# Altium project UCLA-DRS4-2.1.PrjPCB (part 7 of 10)

## Sheet 3V_ADC_SUPPLY.SchDoc: My title
size A3; Organization: University of California; Address1: 475 Portola Plaza; Address2: Los Angeles, CA 90095; DocumentNumber: 9; Revision: R01; SheetNumber: 9; SheetTotal: 35
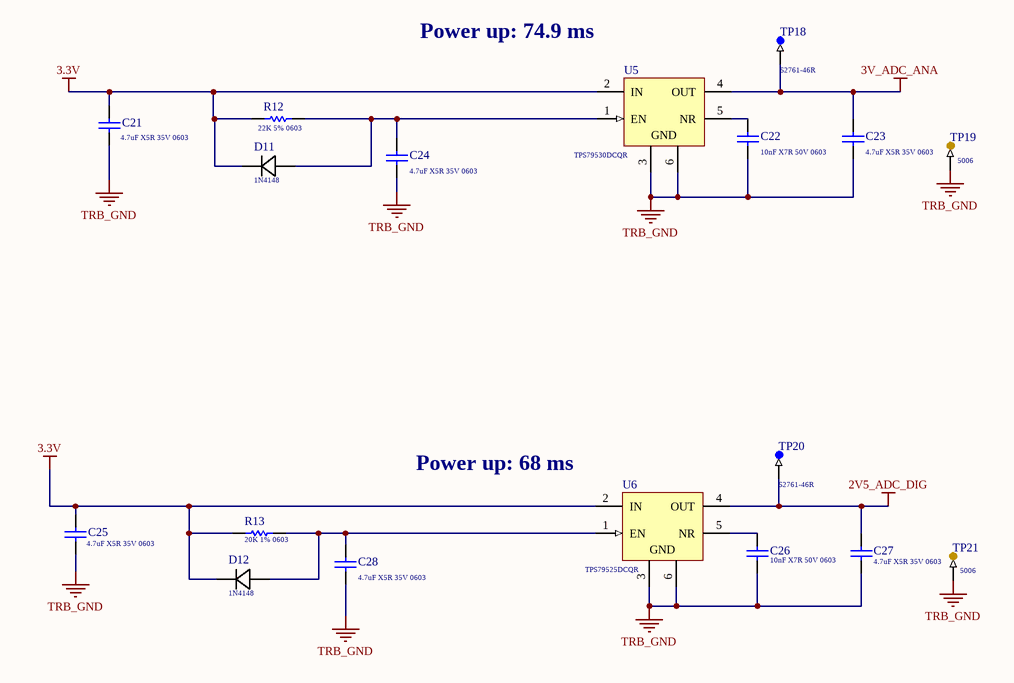
[diagram p18: 3V_ADC_SUPPLY.SchDoc]

### Parts
C21  Capacitance: 4.7uF X5R 35V 0603  [Cap_Murata_ZRB18AR6YA475ME05L_4.7uF]  (hidden comment: Cap_Murata_ZRB18AR6YA475ME05L_4.7uF)
C22  Capacitance: 10nF X7R 50V 0603  [Kemet_C0603_0]  (hidden comment: Cap_Kemet_C0603C103J5RACTU_eec)
C23  Capacitance: 4.7uF X5R 35V 0603  [Cap_Murata_ZRB18AR6YA475ME05L_4.7uF]  (hidden comment: Cap_Murata_ZRB18AR6YA475ME05L_4.7uF)
C24  Capacitance: 4.7uF X5R 35V 0603  [Cap_Murata_ZRB18AR6YA475ME05L_4.7uF]  (hidden comment: Cap_Murata_ZRB18AR6YA475ME05L_4.7uF)
C25  Capacitance: 4.7uF X5R 35V 0603  [Cap_Murata_ZRB18AR6YA475ME05L_4.7uF]  (hidden comment: Cap_Murata_ZRB18AR6YA475ME05L_4.7uF)
C26  Capacitance: 10nF X7R 50V 0603  [Kemet_C0603_0]  (hidden comment: Cap_Kemet_C0603C103J5RACTU_eec)
C27  Capacitance: 4.7uF X5R 35V 0603  [Cap_Murata_ZRB18AR6YA475ME05L_4.7uF]  (hidden comment: Cap_Murata_ZRB18AR6YA475ME05L_4.7uF)
C28  Capacitance: 4.7uF X5R 35V 0603  [Cap_Murata_ZRB18AR6YA475ME05L_4.7uF]  (hidden comment: Cap_Murata_ZRB18AR6YA475ME05L_4.7uF)
D11  Series: 1N4148  [Diode_ON_Semiconductor_1N4148WT_300mA]  (hidden comment: Diode_ON_Semiconductor_1N4148WT_300mA)
D12  Series: 1N4148  [Diode_ON_Semiconductor_1N4148WT_300mA]  (hidden comment: Diode_ON_Semiconductor_1N4148WT_300mA)
R12  22K 5% 0603  [RESC0603(1608)_L]
R13  20K 1% 0603  [RESC0603(1608)_L]
TP18  Series: S2761-46R  [TP_Harwin_S2761_46R]  (hidden comment: TP_Harwin_S2761_46R)
TP19  Series: 5006  [TP_Keystone_Electronics_5006]  (hidden comment: TP_Keystone_Electronics_5006)
TP20  Series: S2761-46R  [TP_Harwin_S2761_46R]  (hidden comment: TP_Harwin_S2761_46R)
TP21  Series: 5006  [TP_Keystone_Electronics_5006]  (hidden comment: TP_Keystone_Electronics_5006)
U5  TPS79530DCQR  [TI-DCQ6_N]
U6  TPS79525DCQR  [DCQ0006A_N]

### Nets
2V5_ADC_DIG: C27.2 TP20.1 U6.4(OUT)
3.3V: C21.2 C25.2 D11.1 D12.1 R12.1 R13.2 U5.2(IN) U6.2(IN)
3V_ADC_ANA: C23.2 TP18.1 U5.4(OUT)
TRB_GND: C21.1 C22.2 C23.1 C24.1 C25.1 C26.2 C27.1 C28.1 TP19.1 TP21.1 U5.3(GND) U5.6(GND) U6.3(GND) U6.6(GND)
NetC22_1: C22.1 U5.5(NR)
NetC24_2: C24.2 D11.2 R12.2 U5.1(EN)
NetC26_1: C26.1 U6.5(NR)
NetC28_2: C28.2 D12.2 R13.1 U6.1(EN)

### Notes on the sheet
- (near U5) Power up: 74.9 ms
- (near U6) Power up: 68 ms
- 475 Portola Plaza
- GAPS TOF
- igarcia91@g.ucla.edu
- Los Angeles, CA
- 310-825-0344
- Size:
- Date:
- Letter
- Revision:
- Time:
- Sheet
- of
- andrew.peck@cern.ch
- spq@ucla.edu
- File:

### Library data of the parts
C21 C23-C25 C27 C28 = Cap_Murata_ZRB18AR6YA475ME05L_4.7uF: CAP CER 4.7uF 35V X5R 0603; Supplier 1: Mouser; Supplier Part Number 1: 81-ZRB18AR6YA475ME5L
C22 C26 = Cap_Kemet_C0603C103J5RACTU_eec: CAP CER 10nF 50V X7R 0603; Manufacturer: Kemet; Mfg Package Ident: C0603; Part Number: C0603C103J5RACTU; helpURL: https://upverter.com/upn/revision/8a8d0c297e33ac74/; ComponentLink2Description: Datasheet; Temperature: -55°C to +125°C; Package: C0603; Supplier 2: Mouser; Price: 0.0184203126773; Supplier 1: Digi-Key; ComponentLink1URL: https://upverter.com/upn/revision/8a8d0c297e33ac74/; Supplier Part Number 2: 80-C0603C103J5R; Supplier Part Number 1: 399-1092-1-ND; Value: 10nF; ComponentLink1Description: Upverter; ComponentLink2URL: https://content.kemet.com/datasheets/KEM_C1002_X7R_SMD.pdf; RoHS: TRUE; Mouser Part Number: 80-C0603C103J5R; Temperature Range High: +125°C; Digikey Description: CAP CER 10000PF 50V X7R 0603; Digikey Part Number: 399-1092-1-ND; Lead Free: yes; Temperature Range Low: -55°C; Voltage: 50V
D11 D12 = Diode_ON_Semiconductor_1N4148WT_300mA: Diodes - General Purpose, Power, Switching SINGLE JUNC. 75V 4.0NS COMP; Supplier 1: Mouser; Supplier Part Number 1: 512-1N4148WT
R12 = CMP-1012-00106-1: 22K 0.1W 5% 0603 (1608 Metric)  SMD; Case-Metric: 1608; Value: 22000.00 Ohm; Case-EIA: 0603; Power: 0.1 W; Tolerance: 5 %; Technology: SMT
R13 = CMP-1012-00655-1: 20K 0.1W 1% 0603 (1608 Metric)  SMD; Case-Metric: 1608; Case-EIA: 0603; Value: 20000.00 Ohm; Technology: SMT; Tolerance: 1 %; Power: 0.1 W
TP18 TP20 = TP_Harwin_S2761_46R: Circuit Board Hardware - PCB SMT Mini Test Terminal, Reel; Supplier 1: Newark; Supplier Part Number 1: 76Y5391
TP19 TP21 = TP_Keystone_Electronics_5006: Circuit Board Hardware - PCB TEST POINT BLK .063; Supplier 1: Mouser; Supplier Part Number 1: 534-5006
U5 = TPS79530DCQR: Single Output High PSRR LDO, 500 mA, Fixed 3 V Output, 2.7 to 5.5 V Input, 6-pin SOT-223 (DCQ), -40 to 125 degC, Green (RoHS & no Sb/Br); Manufacturer: Texas Instruments; Accuracy(%): 2; Iq(Typ)(mA): 0.26; Vin(Min)(V): 2.7; Vout Adj(Min)(V): 3; SubFamily: Single Channel LDO; Vin(Max)(V): 5.5; Rating: Catalog; Iout(Max)(A): 0.5; Vdo(Typ)(mV): 110; Eco-Plan: Green (RoHS & no Sb/Br); PartNumber: TPS79530DCQR; ComponentLink1Description: Manufacturer URL; ComponentLink2Description: Datasheet; DatasheetVersion: SLVS350H; ComponentLink3URL: http://www.ti.com/litv/pdf/mpds098c; Vout Adj(Max)(V): 3; ComponentLink1URL: http://www.ti.com/; Fixed Output Options(V): 3; ComponentLink2URL: http://www.ti.com/general/docs/lit/getliterature.tsp?genericPartNumber=TPS79530&fileType=pdf; ComponentLink3Description: Package Specification; PackageVersion: 4202109/D; Mounting Technology: Surface Mount; PackageReference: DCQ6; PackageDescription: 6-Pin Plastic Small Outline, Body 3.5 x 6.5 mm, Pitch 1.27 mm; Supplier 1: Mouser; Supplier Part Number 1: 595-TPS79530DCQR
U6 = TPS79525DCQR: Single Output High PSRR LDO, 500 mA, Fixed 2.5 V Output, 2.7 to 5.5 V Input, 6-pin SOT-223 (DCQ), -40 to 125 degC, Green (RoHS & no Sb/Br); Manufacturer: Texas Instruments; Accuracy(%): 2; Iq(Typ)(mA): 0.26; Vin(Min)(V): 2.7; Vout Adj(Min)(V): 2.5; SubFamily: Single Channel LDO; Vin(Max)(V): 5.5; Rating: Catalog; Iout(Max)(A): 0.5; Vdo(Typ)(mV): 110; Eco-Plan: Green (RoHS & no Sb/Br); PartNumber: TPS79525DCQR; ComponentLink1Description: Manufacturer URL; ComponentLink2Description: Datasheet; DatasheetVersion: SLVS350H; ComponentLink3URL: http://www.ti.com/litv/pdf/mpds098c; Vout Adj(Max)(V): 2.5; ComponentLink1URL: http://www.ti.com/; Fixed Output Options(V): 2.5; ComponentLink2URL: http://www.ti.com/general/docs/lit/getliterature.tsp?genericPartNumber=TPS79525&fileType=pdf; PackageReference: DCQ0006A; ComponentLink3Description: Package Specification; PackageVersion: 4202109/D; Mounting Technology: Surface Mount; PackageDescription: 6-Pin Plastic Small Outline, Body 3.5 x 6.5 mm, Pitch 1.27 mm; Supplier 1: Mouser; Supplier 2: Digi-Key; Supplier 3: Arrow; Supplier Part Number 3: TPS79525DCQR; Supplier Part Number 2: 296-41778-6-ND; Supplier Part Number 1: 595-TPS79525DCQR

## Sheet MarsCarrier_PWR.SchDoc: My title
size A3; Organization: University of California; Address1: 475 Portola Plaza; Address2: Los Angeles, CA 90095; DocumentNumber: 13; Revision: R01; SheetNumber: 13; SheetTotal: 35
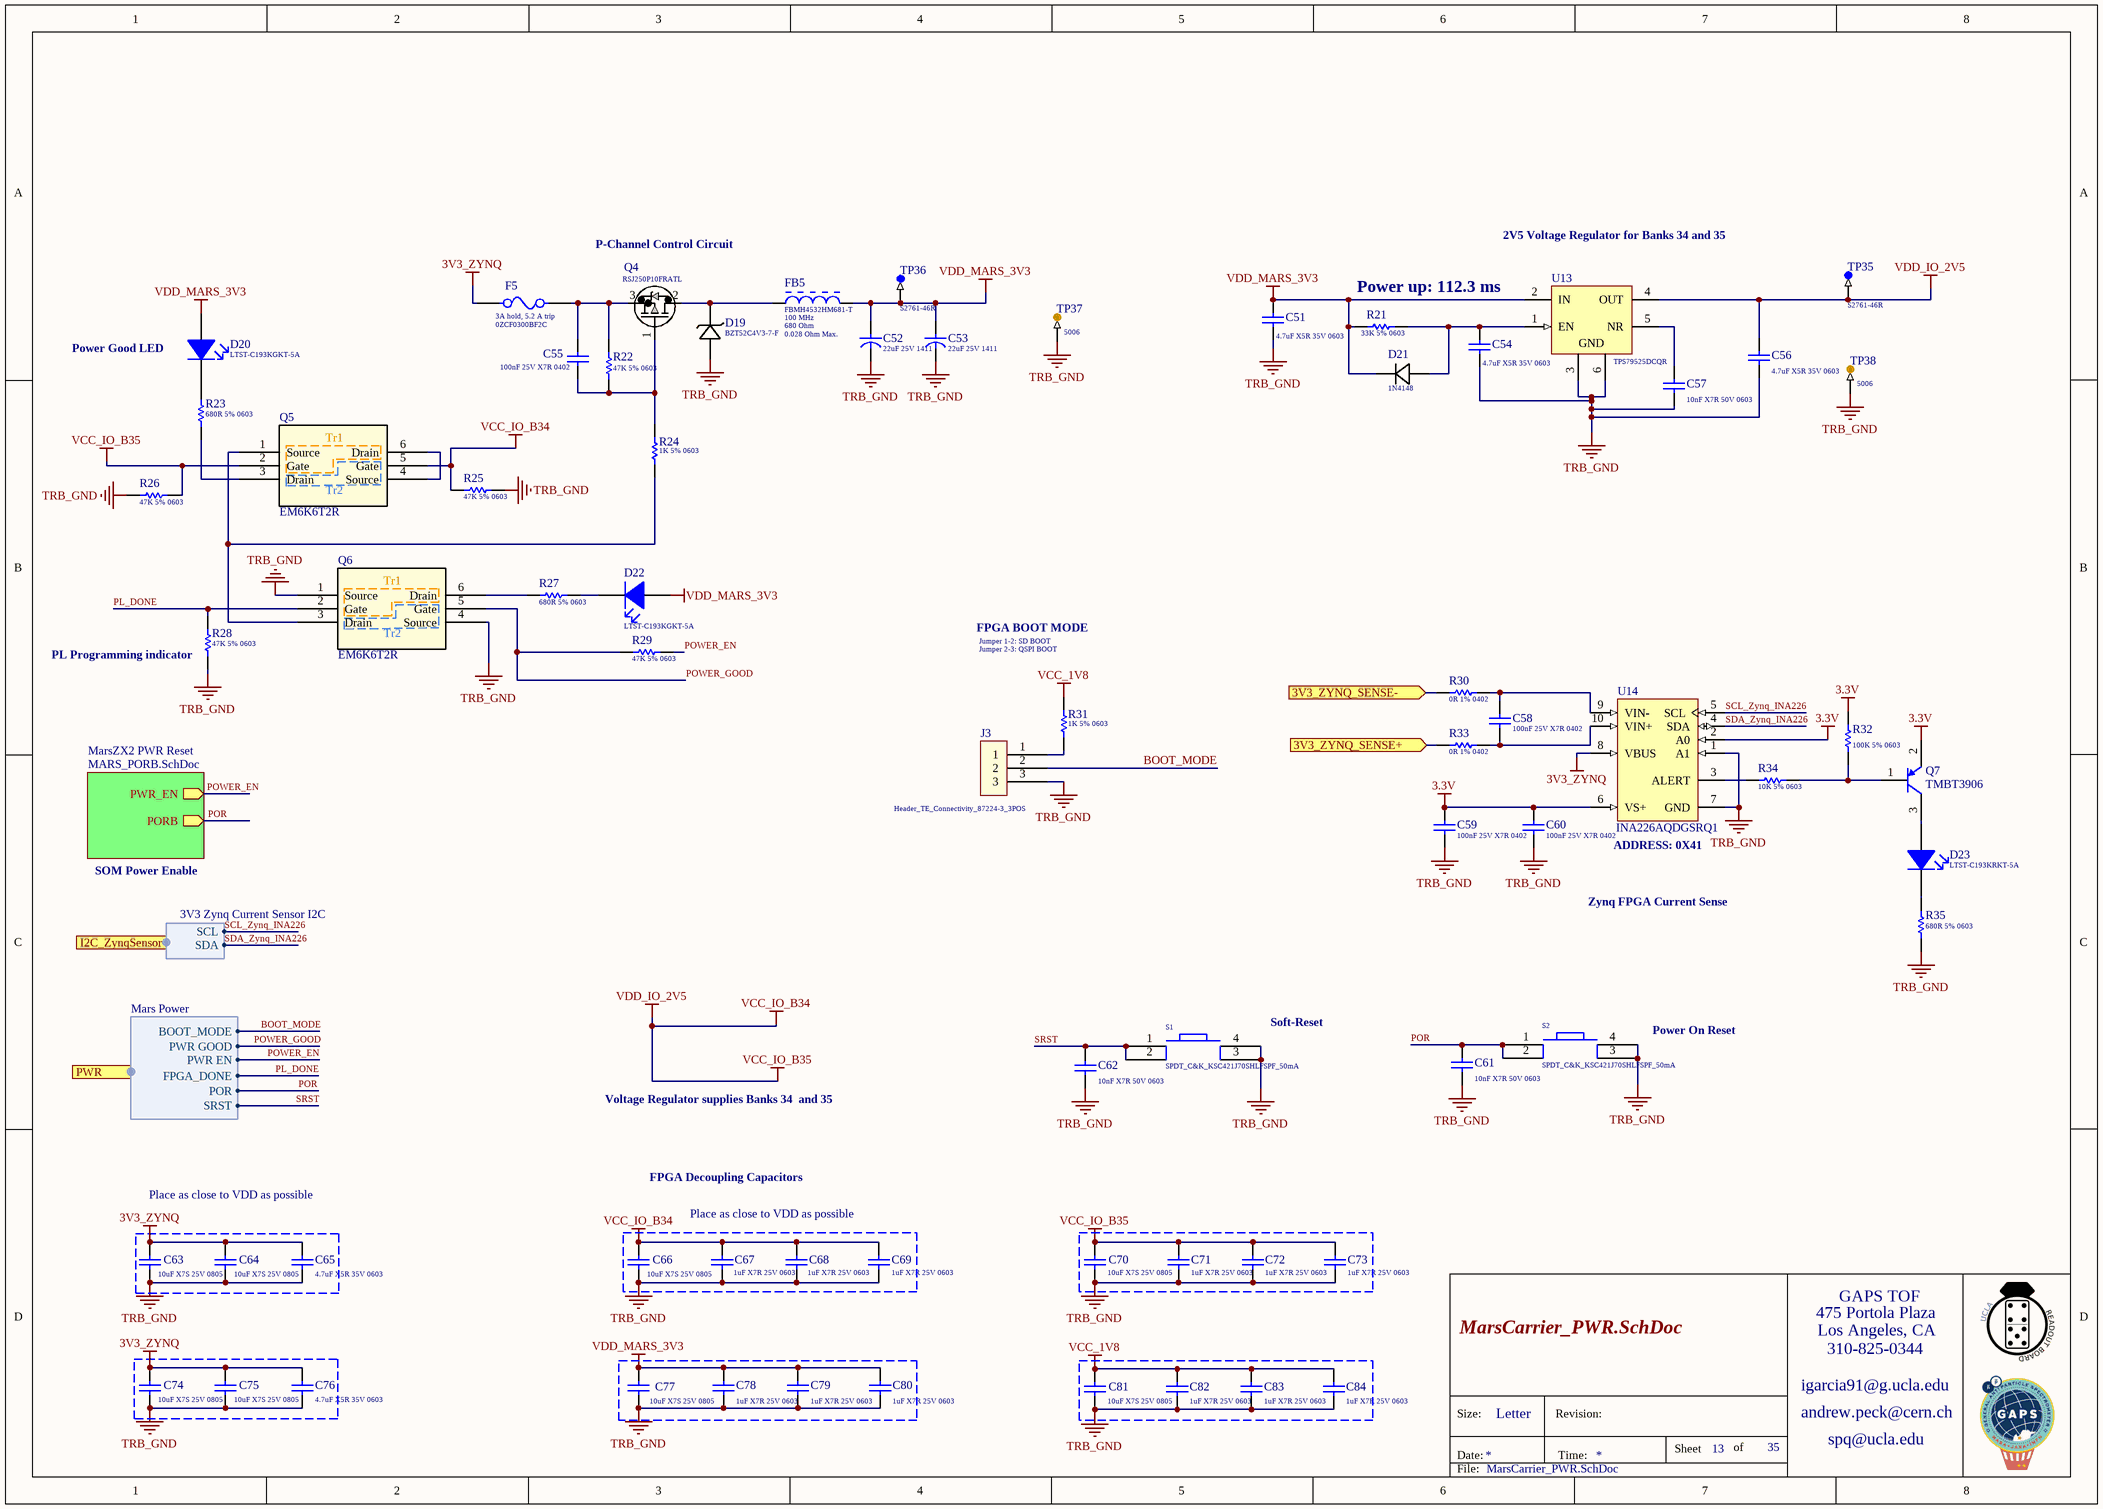
[diagram p19: MarsCarrier_PWR.SchDoc]

### Parts
C51  Capacitance: 4.7uF X5R 35V 0603  [Cap_Murata_ZRB18AR6YA475ME05L_4.7uF]  (hidden comment: Cap_Murata_ZRB18AR6YA475ME05L_4.7uF)
C52  Capacitance: 22uF 25V 1411  [Cap_Kemet_T521B226M025ATE100_22uF]  (hidden comment: Cap_Kemet_T521B226M025ATE100_22uF)
C53  Capacitance: 22uF 25V 1411  [Cap_Kemet_T521B226M025ATE100_22uF]  (hidden comment: Cap_Kemet_T521B226M025ATE100_22uF)
C54  Capacitance: 4.7uF X5R 35V 0603  [Cap_Murata_ZRB18AR6YA475ME05L_4.7uF]  (hidden comment: Cap_Murata_ZRB18AR6YA475ME05L_4.7uF)
C55  Capacitance: 100nF 25V X7R 0402  [Cap_Taiyo_Yuden_TMK105B7104KV-FR_100nF]  (hidden comment: Cap_Taiyo_Yuden_TMK105B7104KV-FR_100nF)
C56  Capacitance: 4.7uF X5R 35V 0603  [Cap_Murata_ZRB18AR6YA475ME05L_4.7uF]  (hidden comment: Cap_Murata_ZRB18AR6YA475ME05L_4.7uF)
C57  Capacitance: 10nF X7R 50V 0603  [Kemet_C0603_0]  (hidden comment: Cap_Kemet_C0603C103J5RACTU_eec)
C58  Capacitance: 100nF 25V X7R 0402  [Cap_Taiyo_Yuden_TMK105B7104KV-FR_100nF]  (hidden comment: Cap_Taiyo_Yuden_TMK105B7104KV-FR_100nF)
C59  Capacitance: 100nF 25V X7R 0402  [Cap_Taiyo_Yuden_TMK105B7104KV-FR_100nF]  (hidden comment: Cap_Taiyo_Yuden_TMK105B7104KV-FR_100nF)
C60  Capacitance: 100nF 25V X7R 0402  [Cap_Taiyo_Yuden_TMK105B7104KV-FR_100nF]  (hidden comment: Cap_Taiyo_Yuden_TMK105B7104KV-FR_100nF)
C61  Capacitance: 10nF X7R 50V 0603  [Kemet_C0603_0]  (hidden comment: Cap_Kemet_C0603C103J5RACTU_eec)
C62  Capacitance: 10nF X7R 50V 0603  [Kemet_C0603_0]  (hidden comment: Cap_Kemet_C0603C103J5RACTU_eec)
C63  Capacitance: 10uF X7S 25V 0805  [Cap_Murata_ GRM21BC71E106ME11L_10uF]  (hidden comment: Cap_Murata_ GRM21BC71E106ME11L_10uF)
C64  Capacitance: 10uF X7S 25V 0805  [Cap_Murata_ GRM21BC71E106ME11L_10uF]  (hidden comment: Cap_Murata_ GRM21BC71E106ME11L_10uF)
C65  Capacitance: 4.7uF X5R 35V 0603  [Cap_Murata_ZRB18AR6YA475ME05L_4.7uF]  (hidden comment: Cap_Murata_ZRB18AR6YA475ME05L_4.7uF)
C66  Capacitance: 10uF X7S 25V 0805  [Cap_Murata_ GRM21BC71E106ME11L_10uF]  (hidden comment: Cap_Murata_ GRM21BC71E106ME11L_10uF)
C67  Capacitance: 1uF X7R 25V 0603  [Cap_Murata_GCJ188R71E105KA01J_1uF]  (hidden comment: Cap_Murata_GCJ188R71E105KA01J_1uF)
C68  Capacitance: 1uF X7R 25V 0603  [Cap_Murata_GCJ188R71E105KA01J_1uF]  (hidden comment: Cap_Murata_GCJ188R71E105KA01J_1uF)
C69  Capacitance: 1uF X7R 25V 0603  [Cap_Murata_GCJ188R71E105KA01J_1uF]  (hidden comment: Cap_Murata_GCJ188R71E105KA01J_1uF)
C70  Capacitance: 10uF X7S 25V 0805  [Cap_Murata_ GRM21BC71E106ME11L_10uF]  (hidden comment: Cap_Murata_ GRM21BC71E106ME11L_10uF)
C71  Capacitance: 1uF X7R 25V 0603  [Cap_Murata_GCJ188R71E105KA01J_1uF]  (hidden comment: Cap_Murata_GCJ188R71E105KA01J_1uF)
C72  Capacitance: 1uF X7R 25V 0603  [Cap_Murata_GCJ188R71E105KA01J_1uF]  (hidden comment: Cap_Murata_GCJ188R71E105KA01J_1uF)
C73  Capacitance: 1uF X7R 25V 0603  [Cap_Murata_GCJ188R71E105KA01J_1uF]  (hidden comment: Cap_Murata_GCJ188R71E105KA01J_1uF)
C74  Capacitance: 10uF X7S 25V 0805  [Cap_Murata_ GRM21BC71E106ME11L_10uF]  (hidden comment: Cap_Murata_ GRM21BC71E106ME11L_10uF)
C75  Capacitance: 10uF X7S 25V 0805  [Cap_Murata_ GRM21BC71E106ME11L_10uF]  (hidden comment: Cap_Murata_ GRM21BC71E106ME11L_10uF)
C76  Capacitance: 4.7uF X5R 35V 0603  [Cap_Murata_ZRB18AR6YA475ME05L_4.7uF]  (hidden comment: Cap_Murata_ZRB18AR6YA475ME05L_4.7uF)
C77  Capacitance: 10uF X7S 25V 0805  [Cap_Murata_ GRM21BC71E106ME11L_10uF]  (hidden comment: Cap_Murata_ GRM21BC71E106ME11L_10uF)
C78  Capacitance: 1uF X7R 25V 0603  [Cap_Murata_GCJ188R71E105KA01J_1uF]  (hidden comment: Cap_Murata_GCJ188R71E105KA01J_1uF)
C79  Capacitance: 1uF X7R 25V 0603  [Cap_Murata_GCJ188R71E105KA01J_1uF]  (hidden comment: Cap_Murata_GCJ188R71E105KA01J_1uF)
C80  Capacitance: 1uF X7R 25V 0603  [Cap_Murata_GCJ188R71E105KA01J_1uF]  (hidden comment: Cap_Murata_GCJ188R71E105KA01J_1uF)
C81  Capacitance: 10uF X7S 25V 0805  [Cap_Murata_ GRM21BC71E106ME11L_10uF]  (hidden comment: Cap_Murata_ GRM21BC71E106ME11L_10uF)
C82  Capacitance: 1uF X7R 25V 0603  [Cap_Murata_GCJ188R71E105KA01J_1uF]  (hidden comment: Cap_Murata_GCJ188R71E105KA01J_1uF)
C83  Capacitance: 1uF X7R 25V 0603  [Cap_Murata_GCJ188R71E105KA01J_1uF]  (hidden comment: Cap_Murata_GCJ188R71E105KA01J_1uF)
C84  Capacitance: 1uF X7R 25V 0603  [Cap_Murata_GCJ188R71E105KA01J_1uF]  (hidden comment: Cap_Murata_GCJ188R71E105KA01J_1uF)
D19  BZT52C4V3-7-F  [SOD123]
D20  Series: LTST-C193KGKT-5A  [Led_Lite-On_LTST-C193KGKT-5A_Green]  (hidden comment: Led_Lite-On_LTST-C193KGKT-5A_Green)
D21  Series: 1N4148  [Diode_ON_Semiconductor_1N4148WT_300mA]  (hidden comment: Diode_ON_Semiconductor_1N4148WT_300mA)
D22  Series: LTST-C193KGKT-5A  [Led_Lite-On_LTST-C193KGKT-5A_Green]  (hidden comment: Led_Lite-On_LTST-C193KGKT-5A_Green)
D23  LTST-C193KRKT-5A  [Led_Lite-On_LTST-C193KGKT-5A_Red]
F5  3A hold, 5.2 A trip  [Bel_0ZCF_MFG]
FB5  Measuring Frequency: 100 MHz  Nominal Impedance: 680 Ohm  DC Resistance: 0.028 Ohm Max.  [TAYO-FBMH4532-2_V]  (hidden comment: FBMH4532HM681-T)
J3  Header_TE_Connectivity_87224-3_3POS  [Header_TE_Connectivity_87224-3_3POS]
Q4  Series: RSJ250P10FRATL  [Mos_ROHM_RSJ250P10FRATL_25A]  (hidden comment: Mos_ROHM_RSJ250P10FRATL_25A)
Q5  EM6K6T2R  [TRANS_EM6_ROM]
Q6  EM6K6T2R  [TRANS_EM6_ROM]
Q7  Series: TMBT3906  [BJT_PNP_Toshiba_TMBT3906]  (hidden comment: BJT_PNP_Toshiba_TMBT3906)
R21  33K 5% 0603  [RESC0603(1608)_L]
R22  47K 5% 0603  [RESC0603(1608)_L]
R23  680R 5% 0603  [RESC0603(1608)_L]
R24  1K 5% 0603  [RESC0603(1608)_L]
R25  47K 5% 0603  [RESC0603(1608)_L]
R26  47K 5% 0603  [RESC0603(1608)_L]
R27  680R 5% 0603  [RESC0603(1608)_L]
R28  47K 5% 0603  [RESC0603(1608)_L]
R29  47K 5% 0603  [RESC0603(1608)_L]
R30  Resistance: 0R 1% 0402  [Res_Vishay_CRCW04020000Z0EDC_0_Ohm]  (hidden comment: Res_Vishay_CRCW04020000Z0EDC_0_Ohm)
R31  1K 5% 0603  [RESC0603(1608)_L]
R32  100K 5% 0603  [RESC0603(1608)_N]
R33  Resistance: 0R 1% 0402  [Res_Vishay_CRCW04020000Z0EDC_0_Ohm]  (hidden comment: Res_Vishay_CRCW04020000Z0EDC_0_Ohm)
R34  10K 5% 0603  [RESC0603(1608)_L]
R35  680R 5% 0603  [RESC0603(1608)_L]
S1  SPDT_C&K_KSC421J70SHLFSPF_50mA  [SPDT_C&K_KSC421J70SHLFSPF_50mA]
S2  SPDT_C&K_KSC421J70SHLFSPF_50mA  [SPDT_C&K_KSC421J70SHLFSPF_50mA]
TP35  Series: S2761-46R  [TP_Harwin_S2761_46R]  (hidden comment: TP_Harwin_S2761_46R)
TP36  Series: S2761-46R  [TP_Harwin_S2761_46R]  (hidden comment: TP_Harwin_S2761_46R)
TP37  Series: 5006  [TP_Keystone_Electronics_5006]  (hidden comment: TP_Keystone_Electronics_5006)
TP38  Series: 5006  [TP_Keystone_Electronics_5006]  (hidden comment: TP_Keystone_Electronics_5006)
U13  TPS79525DCQR  [DCQ0006A_L]
U14  INA226AQDGSRQ1  [INA226AQDGSRQ1]

### Blocks framed on the sheet
Place as close to VDD as possible: C66-C69

### Sub-sheets
MarsZX2 PWR Reset = MARS_PORB.SchDoc: PWR_EN (out), PORB (out)

### Ports
3V3_ZYNQ_SENSE+ (in), 3V3_ZYNQ_SENSE- (in), I2C_ZynqSensor (harness 3V3 Zynq Current Sensor I2C), PWR (harness Mars Power)

### Harnesses
Mars Power: PWR GOOD, PWR EN, FPGA_DONE, SRST, POR, BOOT_MODE
3V3 Zynq Current Sensor I2C: SCL, SDA

### Nets
3.3V: C59.2 C60.2 Q7.2(E) R32.2 U14.2(A0) U14.6(VS+)
3V3_ZYNQ: C63.1 C64.1 C65.1 C74.1 C75.1 C76.1 F5.1 U14.8(VBUS)  [project net VCC_3V3]
TRB_GND: C51.1 C52.2 C53.2 C54.1 C56.1 C57.2 C59.1 C60.1 C61.2 C62.2 C63.2 C64.2 C65.2 C66.2 C67.1 C68.1 C69.1 C70.2 C71.1 C72.1 C73.1 C74.2 C75.2 C76.2 C77.2 C78.1 C79.1 C80.1 C81.2 C82.1 C83.1 C84.1 D19.2 J3.3 Q6.1(Source) Q6.4(Source) R25.2 R26.2 R28.1 R35.1 S1.3 S1.4 S2.3 S2.4 TP37.1 TP38.1 U13.3(GND) U13.6(GND) U14.1(A1) U14.7(GND)
VCC_1V8: C81.1 C82.2 C83.2 C84.2 R31.2  [project net VCC_1V8_PS]
VCC_IO_B34: C56.2 C66.1 C67.2 C68.2 C69.2 C70.1 C71.2 C72.2 C73.2 Q5.2(Gate) Q5.5(Gate) R25.1 R26.1 TP35.1 U13.4(OUT)  [also labelled VCC_IO_B35, VDD_IO_2V5]
VDD_MARS_3V3: C51.2 C52.1 C53.1 C77.1 C78.2 C79.2 C80.2 D20.2(A) D21.1 D22.2(A) FB5.2 R21.1 TP36.1 U13.2(IN)
3V3_ZYNQ_SENSE_N: R30.1 ; port 3V3_ZYNQ_SENSE-
3V3_ZYNQ_SENSE_P: R33.1 ; port 3V3_ZYNQ_SENSE+
BOOT_MODE: J3.2 ; port PWR.BOOT_MODE
PL_DONE: Q6.2(Gate) R28.2 ; port PWR.FPGA_DONE  [project net FPGA_DONE]
POR: C61.1 S2.1 S2.2 ; sheet MarsZX2 PWR Reset/PORB, port PWR.POR
POWER_EN: R29.1 ; sheet MarsZX2 PWR Reset/PWR_EN, port PWR.PWR EN
POWER_GOOD: Q6.5(Gate) R29.2 ; port PWR.PWR GOOD
SCL_Zynq_INA226: U14.5(SCL) ; port I2C_ZynqSensor.SCL
SDA_Zynq_INA226: U14.4(SDA) ; port I2C_ZynqSensor.SDA
SRST: C62.1 S1.1 S1.2 ; port PWR.SRST  [project net PS_SRST#]
NetC54_2: C54.2 D21.2 R21.2 U13.1(EN)
NetC55_1: C55.1 Q4.1(G) R22.1 R24.2
NetC55_2: C55.2 F5.2 Q4.3(S) R22.2
NetC57_1: C57.1 U13.5(NR)
NetC58_1: C58.1 R33.2 U14.10(VIN+)
NetC58_2: C58.2 R30.2 U14.9(VIN-)
NetD19_1: D19.1 FB5.1 Q4.2(D)
NetD20_1: D20.1(K) R23.2
NetD22_1: D22.1(K) R27.1
NetD23_1: D23.1(K) R35.2
NetD23_2: D23.2(A) Q7.3(C)
NetJ3_1: J3.1 R31.1
NetQ5_1: Q5.1(Source) Q6.3(Drain) R24.1
NetQ5_3: Q5.3(Drain) R23.1
NetQ5_4: Q5.4(Source) Q5.6(Drain)
NetQ6_6: Q6.6(Drain) R27.2
NetQ7_1: Q7.1(B) R32.1 R34.1
NetR34_2: R34.2 U14.3(ALERT)

### Notes on the sheet
- P-Channel Control Circuit
- 2V5 Voltage Regulator for Banks 34 and 35
- Power up: 112.3 ms
- Power Good LED
- FPGA BOOT MODE
- Jumper 1-2: SD BOOT
- Jumper 2-3: QSPI BOOT
- (near R28) PL Programming indicator
- (near U14) ADDRESS: 0X41
- SOM Power Enable
- Zynq FPGA Current Sense
- (near S1) Soft-Reset
- Power On Reset
- Voltage Regulator supplies Banks 34  and 35
- FPGA Decoupling Capacitors
- Place as close to VDD as possible
- 475 Portola Plaza
- GAPS TOF
- igarcia91@g.ucla.edu
- Los Angeles, CA
- 310-825-0344
- Size:
- Date:
- Letter
- Revision:
- Time:
- Sheet
- of
- andrew.peck@cern.ch
- spq@ucla.edu
- File:
- (in symbol EM6K6T2R) Tr1; Tr2

### Library data of the parts
C51 C54 C56 C65 C76 = Cap_Murata_ZRB18AR6YA475ME05L_4.7uF: CAP CER 4.7uF 35V X5R 0603; Supplier 1: Mouser; Supplier Part Number 1: 81-ZRB18AR6YA475ME5L
C52 C53 = Cap_Kemet_T521B226M025ATE100_22uF: Tantalum Capacitors - Polymer SMD 25V 22uF 1311 20% ESR=100mOhms; Supplier 1: Mouser; Supplier Part Number 1: 80-T521B226M25ATE100
C55 C58-C60 = Cap_Taiyo_Yuden_TMK105B7104KV-FR_100nF: CAP CER 100nF 25V X7R 0402; Supplier 1: Mouser; Supplier Part Number 1: 963-TMK105B7104KV-FR
C57 C61 C62 = Cap_Kemet_C0603C103J5RACTU_eec: as C22 on sheet 3V_ADC_SUPPLY; Part Number: C0603C103J5RACTU; helpURL: https://upverter.com/upn/revision/8a8d0c297e33ac74/; ComponentLink2Description: Datasheet; Temperature: -55°C to +125°C; Package: C0603; Supplier 2: Mouser; Price: 0.0184203126773; Supplier 1: Digi-Key; ComponentLink1URL: https://upverter.com/upn/revision/8a8d0c297e33ac74/; Supplier Part Number 2: 80-C0603C103J5R; Supplier Part Number 1: 399-1092-1-ND; Value: 10nF; ComponentLink1Description: Upverter; ComponentLink2URL: https://content.kemet.com/datasheets/KEM_C1002_X7R_SMD.pdf; RoHS: TRUE; Mouser Part Number: 80-C0603C103J5R; Temperature Range High: +125°C; Digikey Description: CAP CER 10000PF 50V X7R 0603; Digikey Part Number: 399-1092-1-ND; Lead Free: yes; Temperature Range Low: -55°C; Voltage: 50V
C63 C64 C66 C70 C74 C75 C77 C81 = Cap_Murata_ GRM21BC71E106ME11L_10uF: CAP CER 10uF 25V X7R 0805; Supplier 1: Mouser; Supplier Part Number 1: 81-GRM21BC71E106ME1L
C67-C69 C71-C73 C78-C80 C82-C84 = Cap_Murata_GCJ188R71E105KA01J_1uF: CAP CER 1uF 25V X7R 0603; Supplier 1: Mouser; Supplier Part Number 1: 81-GCJ188R71E105KA1J
D19 = BZT52C4V3-7-F: Zener Diodes 500mW 4.3V Zener AEC-Q101 Qualified; Vendor: Diodes Inc; Built_By: EMA_UL_Team; Type: DEV; C: Copyright (C) 2015 Accelerated Designs. All rights reserved; Manufacturer_Part_Number: BZT52C4V3-7-F; RefDes: RefDes; Supplier 1: Mouser; Supplier Part Number 1: 621-BZT52C4V3-F; Series: BZT52C4V3-7-F
D20 D22 = Led_Lite-On_LTST-C193KGKT-5A_Green: Standard LEDs - SMD Green 470nm 28mcd 20mA; Supplier 1: Mouser; Supplier Part Number 1: 859-LTSTC193KGKT5A
D21 = Diode_ON_Semiconductor_1N4148WT_300mA: as D11 on sheet 3V_ADC_SUPPLY; Supplier 1: Mouser; Supplier Part Number 1: 512-1N4148WT
D23 = Led_Lite-On_LTST-C193KGKT-5A_Red: Standard LEDs - SMD Red 470nm 28mcd 20mA; Supplier 1: Mouser; Supplier Part Number 1: 859-LTSTC193KRKT5A; Series: LTST-C193KRKT-5A
F5 = 0ZCF0300BF2C: Resettable Fuses - PPTC 3A 24V PPTC 2920 SMD; Supplier 1: Mouser; Supplier 2: Digi-Key; Supplier Part Number 1: 530-0ZCF0300BF2C; Supplier Part Number 2: 507-2072-6-ND; Series: 0ZCF0300BF2C
FB5 = FBMH4532HM681-T: Chip Bead Inductor for Power Lines, 680 Ohm, 4 A, -40 to 125 degC, 2-Pin 4.5 x 3.2 x 3.5 mm SMD, RoHS, Taping; Manufacturer: Taiyo Yuden; Rated Current: 4 A Max.; Impedance Tolerance: +/- 25%; ComponentLink1Description: Manufacturer URL; ComponentLink2Description: Datasheet; DatasheetVersion: 09/2014; ComponentLink3URL: http://www.yuden.co.jp/productdata/catalog/en/chipbeads01_e.pdf; ComponentLink3Description: Package Specification; ComponentLink1URL: http://www.t-yuden.com/; Mounting Technology: Surface Mount; Packing: Taping; Temperature Range: -40 to 125 degC; PartNumber: FBMH4532HM681-T; PackageDescription: 2-Pin Surface Mount Device, Body 4.5 x 3.2 mm, Height 3.5 mm; ComponentLink2URL: http://www.yuden.co.jp/productdata/catalog/en/chipbeads01_e.pdf; RoHS: TRUE; Supplier 1: Digi-Key; Supplier Part Number 1: 587-1761-6-ND
J3 = Header_TE_Connectivity_87224-3_3POS: Headers & Wire Housings UNSHRD VERT SNGL 3; Supplier 1: Mouser; Supplier Part Number 1: 571-872243
Q4 = Mos_ROHM_RSJ250P10FRATL_25A: MOSFET Pch -100V Vds -25A 0.05Rds(on) 60Qg; Supplier Part Number 1: 755-RSJ250P10FRATL; Supplier 1: Mouser
Q5 Q6 = EM6K6T2R: MOSFET Small Signal Dual N-CH 20V .3A .15W; Vendor: ROHM Semiconductor; Manufacturer_Part_Number: EM6K6T2R
Q7 = BJT_PNP_Toshiba_TMBT3906: Bipolar Transistors - BJT Transistor for Low Freq. Amplification; Manufacturer Part Number 1: TMBT3906,LM; Supplier 1: Mouser; Supplier Part Number 1: 757-TMBT3906LM; Manufacturer: Toshiba
R21 = CMP-1012-00110-1: 33K 0.1W 5% 0603 (1608 Metric)  SMD; Value: 33000.00 Ohm; Case-EIA: 0603; Case-Metric: 1608; Tolerance: 5 %; Power: 0.1 W; Technology: SMT
R22 R25 R26 R28 R29 = CMP-1012-00114-1: 47K 0.1W 5% 0603 (1608 Metric)  SMD; Case-EIA: 0603; Value: 47000.00 Ohm; Case-Metric: 1608; Tolerance: 5 %; Power: 0.1 W; Technology: SMT
R23 R27 R35 = CMP-1012-00070-1: 680R 0.1W 5% 0603 (1608 Metric)  SMD; Case-EIA: 0603; Value: 680.00 Ohm; Case-Metric: 1608; Tolerance: 5 %; Technology: SMT; Power: 0.1 W
R24 R31 = CMP-1012-00074-1: 1K 0.1W 5% 0603 (1608 Metric)  SMD; Case-EIA: 0603; Case-Metric: 1608; Value: 1000.00 Ohm; Technology: SMT; Tolerance: 5 %; Power: 0.1 W
R30 R33 = Res_Vishay_CRCW04020000Z0EDC_0_Ohm: 0R 0.062W 1% 0402 (1005 Metric)  SMD; Supplier 1: Mouser; Supplier Part Number 1: 71-CRCW04020000Z0EDC
R32 = CMP-1012-00122-1: 100K 0.1W 5% 0603 (1608 Metric)  SMD; Case-EIA: 0603; Value: 100000.00 Ohm; Case-Metric: 1608; Tolerance: 5 %; Power: 0.1 W; Technology: SMT
R34 = CMP-1012-00098-1: 10K 0.1W 5% 0603 (1608 Metric)  SMD; Case-EIA: 0603; Value: 10000.00 Ohm; Case-Metric: 1608; Technology: SMT; Tolerance: 5 %; Power: 0.1 W
S1 S2 = SPDT_C&K_KSC421J70SHLFSPF_50mA: Tactile Switches Tact 6.2 x 6.2, 5.1 mm H, 1.7N, J leads, Potting Friendly, IP67; Supplier 1: Mouser; Supplier Part Number 1: 611-KSC421J70SHLFSPF
TP35 TP36 = TP_Harwin_S2761_46R: as TP18 on sheet 3V_ADC_SUPPLY; Supplier 1: Newark; Supplier Part Number 1: 76Y5391
TP37 TP38 = TP_Keystone_Electronics_5006: as TP19 on sheet 3V_ADC_SUPPLY; Supplier 1: Mouser; Supplier Part Number 1: 534-5006
U13 = CMP-0395-00444-2: Single Output High PSRR LDO, 500 mA, Fixed 2.5 V Output, 2.7 to 5.5 V Input, 6-pin SOT-223 (DCQ), -40 to 125 degC, Green (RoHS & no Sb/Br); Manufacturer: Texas Instruments; Iout(Max)(A): 0.5; Vout Adj(Min)(V): 2.5; Vin(Max)(V): 5.5; SubFamily: Single Channel LDO; Vdo(Typ)(mV): 110; Rating: Catalog; Accuracy(%): 2; Iq(Typ)(mA): 0.26; Vin(Min)(V): 2.7; ComponentLink3URL: http://www.ti.com/litv/pdf/mpds098c; ComponentLink1URL: http://www.ti.com/; Eco-Plan: Green (RoHS & no Sb/Br); PackageDescription: 6-Pin Plastic Small Outline, Body 3.5 x 6.5 mm, Pitch 1.27 mm; PartNumber: TPS79525DCQR; Fixed Output Options(V): 2.5; ComponentLink1Description: Manufacturer URL; PackageReference: DCQ0006A; ComponentLink2Description: Datasheet; Vout Adj(Max)(V): 2.5; ComponentLink3Description: Package Specification; ComponentLink2URL: http://www.ti.com/general/docs/lit/getliterature.tsp?genericPartNumber=TPS79525&fileType=pdf; Mounting Technology: Surface Mount; DatasheetVersion: SLVS350H; PackageVersion: 4202109/D; Supplier 1: Mouser; Supplier Part Number 1: 595-TPS79525DCQR
U14 = INA226AQDGSRQ1: Current & Power Monitors & Regulators Automotive, 36-V, Ultra-High Accuracy, Low-/High-Side, I2C Out Current/Power Monitor w/ Alert 10-VSSOP -40 to 125; Supplier 1: Mouser; Supplier Part Number 1: 595-INA226AQDGSRQ1

## Sheet MARS_PORB.SchDoc: My title
size A3; Organization: University of California; Address1: 475 Portola Plaza; Address2: Los Angeles, CA 90095; DocumentNumber: 35; Revision: R01; SheetNumber: 35; SheetTotal: 35
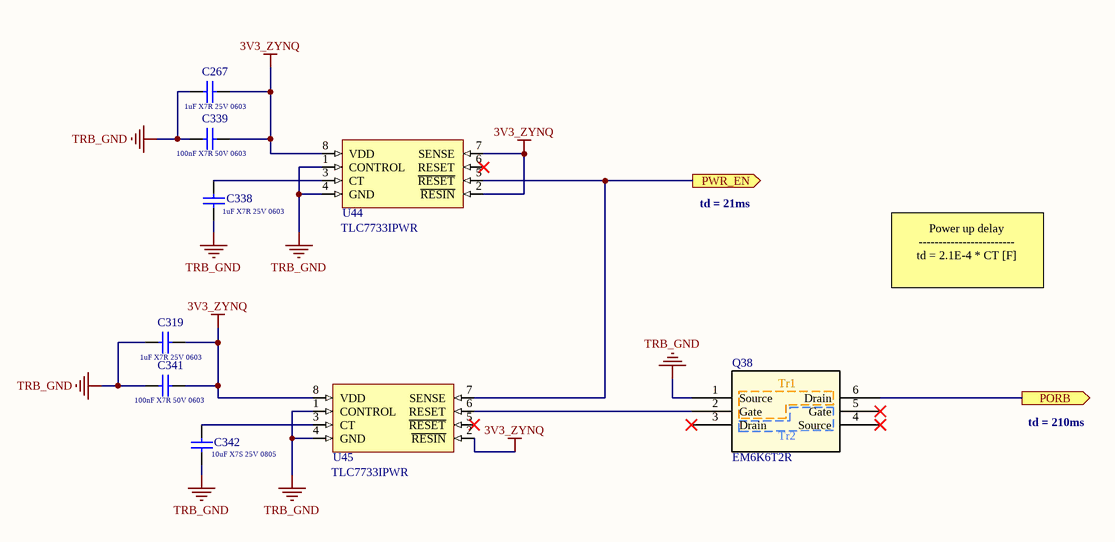
[diagram p20: MARS_PORB.SchDoc]

### Parts
C267  Capacitance: 1uF X7R 25V 0603  [Cap_Murata_GCJ188R71E105KA01J_1uF]  (hidden comment: Cap_Murata_GCJ188R71E105KA01J_1uF)
C319  Capacitance: 1uF X7R 25V 0603  [Cap_Murata_GCJ188R71E105KA01J_1uF]  (hidden comment: Cap_Murata_GCJ188R71E105KA01J_1uF)
C338  Capacitance: 1uF X7R 25V 0603  [Cap_Murata_GCJ188R71E105KA01J_1uF]  (hidden comment: Cap_Murata_GCJ188R71E105KA01J_1uF)
C339  Capacitance: 100nF X7R 50V 0603  [Cap_Kemet_C0603C104M5RACAUTO_100nF]  (hidden comment: Cap_Kemet_C0603C104M5RACAUTO_100nF)
C341  Capacitance: 100nF X7R 50V 0603  [Cap_Kemet_C0603C104M5RACAUTO_100nF]  (hidden comment: Cap_Kemet_C0603C104M5RACAUTO_100nF)
C342  Capacitance: 10uF X7S 25V 0805  [Cap_Murata_ GRM21BC71E106ME11L_10uF]  (hidden comment: Cap_Murata_ GRM21BC71E106ME11L_10uF)
Q38  EM6K6T2R  [TRANS_EM6_ROM]
U44  TLC7733IPWR  [PMU_Texas_Instruments_TLC7733IPWR_2.93]
U45  TLC7733IPWR  [PMU_Texas_Instruments_TLC7733IPWR_2.93]

### Ports
PORB (out), PWR_EN (out)

### Nets
3V3_ZYNQ: C267.1 C319.1 C339.1 C341.1 U44.2(~{RESIN}) U44.7(SENSE) U44.8(VDD) U45.2(~{RESIN}) U45.8(VDD)  [project net VCC_3V3]
TRB_GND: C267.2 C319.2 C338.1 C339.2 C341.2 C342.2 Q38.1(Source) U44.1(CONTROL) U44.4(GND) U45.1(CONTROL) U45.4(GND)
POR: Q38.6(Drain) ; port PORB
POWER_EN: U44.5(~{RESET}) U45.7(SENSE) ; port PWR_EN
NetC338_2: C338.2 U44.3(CT)
NetC342_1: C342.1 U45.3(CT)
NetQ38_2: Q38.2(Gate) U45.6(RESET)

Not connected (* = marked no-connect by the designer): Q38 3(Drain)* 4(Source)* 5(Gate)*; U44 6(RESET)*; U45 5(~{RESET})*

### Notes on the sheet
- td = 21ms
- Power up delay
  ------------------------
  td = 2.1E-4 * CT [F]
- td = 210ms
- 475 Portola Plaza
- GAPS TOF
- igarcia91@g.ucla.edu
- Los Angeles, CA
- 310-825-0344
- Size:
- Date:
- Letter
- Revision:
- Time:
- Sheet
- of
- andrew.peck@cern.ch
- spq@ucla.edu
- File:
- (in symbol EM6K6T2R) Tr1; Tr2

### Library data of the parts
C267 C319 C338 = Cap_Murata_GCJ188R71E105KA01J_1uF: CAP CER 1uF 25V X7R 0603; Supplier 1: Mouser; Supplier Part Number 1: 81-GCJ188R71E105KA1J
C339 C341 = Cap_Kemet_C0603C104M5RACAUTO_100nF: CAP CER 100nF 50V X7R 0603; Supplier 1: Mouser; Supplier Part Number 1: 80-C0603C104M5RAUTO
C342 = Cap_Murata_ GRM21BC71E106ME11L_10uF: CAP CER 10uF 25V X7R 0805; Supplier 1: Mouser; Supplier Part Number 1: 81-GRM21BC71E106ME1L
Q38 = EM6K6T2R: as Q5 on sheet MarsCarrier_PWR; Manufacturer_Part_Number: EM6K6T2R
U44 U45 = PMU_Texas_Instruments_TLC7733IPWR_2.93: Supervisory Circuits 2.93V Monitor; Manufacturer 1: Texas Instruments; Manufacturer Part Number 1: TLC7733IPWR; Supplier 1: Mouser; Supplier Part Number 1: 595-TLC7733IPWR

## Sheet 3V3_DIST_ZYNQ.SchDoc: My title
size A3; Organization: University of California; Address1: 475 Portola Plaza; Address2: Los Angeles, CA 90095; DocumentNumber: 6; Revision: R01; SheetNumber: 6; SheetTotal: 35
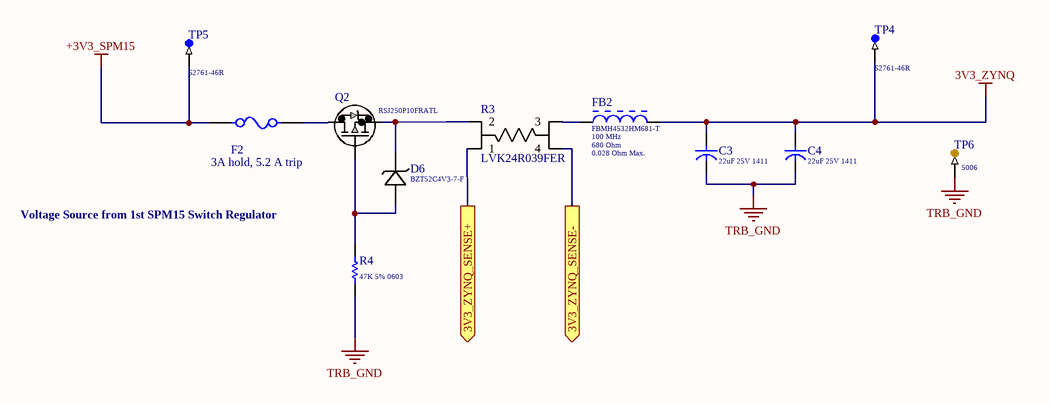
[diagram p21: 3V3_DIST_ZYNQ.SchDoc]

### Parts
C3  Capacitance: 22uF 25V 1411  [Cap_Kemet_T521B226M025ATE100_22uF]  (hidden comment: Cap_Kemet_T521B226M025ATE100_22uF)
C4  Capacitance: 22uF 25V 1411  [Cap_Kemet_T521B226M025ATE100_22uF]  (hidden comment: Cap_Kemet_T521B226M025ATE100_22uF)
D6  BZT52C4V3-7-F  [SOD123]
F2  3A hold, 5.2 A trip  [Bel_0ZCF_MFG]
FB2  Measuring Frequency: 100 MHz  Nominal Impedance: 680 Ohm  DC Resistance: 0.028 Ohm Max.  [TAYO-FBMH4532-2_V]  (hidden comment: FBMH4532HM681-T)
Q2  Series: RSJ250P10FRATL  [Mos_ROHM_RSJ250P10FRATL_25A]  (hidden comment: Mos_ROHM_RSJ250P10FRATL_25A)
R3  LVK24R039FER  [OH_LVK24_OHM]
R4  47K 5% 0603  [RESC0603(1608)_L]
TP4  Series: S2761-46R  [TP_Harwin_S2761_46R]  (hidden comment: TP_Harwin_S2761_46R)
TP5  Series: S2761-46R  [TP_Harwin_S2761_46R]  (hidden comment: TP_Harwin_S2761_46R)
TP6  Series: 5006  [TP_Keystone_Electronics_5006]  (hidden comment: TP_Keystone_Electronics_5006)

### Ports
3V3_ZYNQ_SENSE+ (out), 3V3_ZYNQ_SENSE- (out)

### Nets
3V3_ZYNQ: C3.1 C4.1 FB2.2 TP4.1  [project net VCC_3V3]
+3V3_SPM15: F2.1 TP5.1
TRB_GND: C3.2 C4.2 R4.1 TP6.1
3V3_ZYNQ_SENSE_N: R3.4 ; port 3V3_ZYNQ_SENSE-
3V3_ZYNQ_SENSE_P: R3.1 ; port 3V3_ZYNQ_SENSE+
NetD6_1: D6.1 Q2.3(S) R3.2
NetD6_2: D6.2 Q2.1(G) R4.2
NetF2_2: F2.2 Q2.2(D)
NetFB2_1: FB2.1 R3.3

### Notes on the sheet
- Voltage Source from 1st SPM15 Switch Regulator
- 475 Portola Plaza
- GAPS TOF
- igarcia91@g.ucla.edu
- Los Angeles, CA
- 310-825-0344
- Size:
- Date:
- Letter
- Revision:
- Time:
- Sheet
- of
- andrew.peck@cern.ch
- spq@ucla.edu
- File:

### Library data of the parts
C3 C4 = Cap_Kemet_T521B226M025ATE100_22uF: as C52 on sheet MarsCarrier_PWR; Supplier 1: Mouser; Supplier Part Number 1: 80-T521B226M25ATE100
D6 = BZT52C4V3-7-F: as D19 on sheet MarsCarrier_PWR; Manufacturer_Part_Number: BZT52C4V3-7-F; RefDes: RefDes; Supplier 1: Mouser; Supplier Part Number 1: 621-BZT52C4V3-F; Series: BZT52C4V3-7-F
F2 = 0ZCF0300BF2C: as F5 on sheet MarsCarrier_PWR; Supplier 1: Mouser; Supplier 2: Digi-Key; Supplier Part Number 1: 530-0ZCF0300BF2C; Supplier Part Number 2: 507-2072-6-ND
FB2 = FBMH4532HM681-T: as FB5 on sheet MarsCarrier_PWR; ComponentLink1Description: Manufacturer URL; ComponentLink2Description: Datasheet; DatasheetVersion: 09/2014; ComponentLink3URL: http://www.yuden.co.jp/productdata/catalog/en/chipbeads01_e.pdf; ComponentLink3Description: Package Specification; ComponentLink1URL: http://www.t-yuden.com/; Mounting Technology: Surface Mount; Packing: Taping; Temperature Range: -40 to 125 degC; PartNumber: FBMH4532HM681-T; PackageDescription: 2-Pin Surface Mount Device, Body 4.5 x 3.2 mm, Height 3.5 mm; ComponentLink2URL: http://www.yuden.co.jp/productdata/catalog/en/chipbeads01_e.pdf; RoHS: TRUE; Supplier 1: Digi-Key; Supplier Part Number 1: 587-1761-6-ND
Q2 = Mos_ROHM_RSJ250P10FRATL_25A: as Q4 on sheet MarsCarrier_PWR; Supplier 1: Mouser; Supplier Part Number 1: 755-RSJ250P10FRATL
R3 = LVK24R039FER: RES 0.039 OHM 1% 1W 2412; Vendor: Ohmite; Built_By: EMA_UL_Team; SourceLibrary: Ohmite_2014-12-31; Manufacturer_Part_Number: LVK24R039FER; Copyright: Copyright (C) 2018 Accelerated Designs. All rights reserved; RefDes: RefDes; Type: DEV
R4 = CMP-1012-00114-1: as R22 on sheet MarsCarrier_PWR; Tolerance: 5 %; Power: 0.1 W; Technology: SMT
TP4 TP5 = TP_Harwin_S2761_46R: as TP18 on sheet 3V_ADC_SUPPLY; Supplier 1: Newark; Supplier Part Number 1: 76Y5391
TP6 = TP_Keystone_Electronics_5006: as TP19 on sheet 3V_ADC_SUPPLY; Supplier 1: Mouser; Supplier Part Number 1: 534-5006

## Sheet 3_3V_DIST.SchDoc: My title
size A3; Organization: University of California; Address1: 475 Portola Plaza; Address2: Los Angeles, CA 90095; DocumentNumber: 7; Revision: R01; SheetNumber: 7; SheetTotal: 35
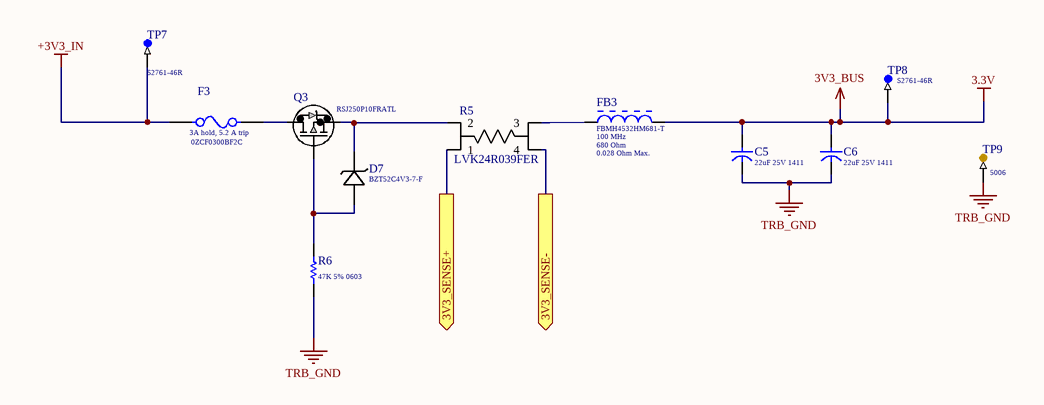
[diagram p22: 3_3V_DIST.SchDoc]

### Parts
C5  Capacitance: 22uF 25V 1411  [Cap_Kemet_T521B226M025ATE100_22uF]  (hidden comment: Cap_Kemet_T521B226M025ATE100_22uF)
C6  Capacitance: 22uF 25V 1411  [Cap_Kemet_T521B226M025ATE100_22uF]  (hidden comment: Cap_Kemet_T521B226M025ATE100_22uF)
D7  BZT52C4V3-7-F  [SOD123]
F3  3A hold, 5.2 A trip  [Bel_0ZCF_MFG]
FB3  Measuring Frequency: 100 MHz  Nominal Impedance: 680 Ohm  DC Resistance: 0.028 Ohm Max.  [TAYO-FBMH4532-2_V]  (hidden comment: FBMH4532HM681-T)
Q3  Series: RSJ250P10FRATL  [Mos_ROHM_RSJ250P10FRATL_25A]  (hidden comment: Mos_ROHM_RSJ250P10FRATL_25A)
R5  LVK24R039FER  [OH_LVK24_OHM]
R6  47K 5% 0603  [RESC0603(1608)_L]
TP7  Series: S2761-46R  [TP_Harwin_S2761_46R]  (hidden comment: TP_Harwin_S2761_46R)
TP8  Series: S2761-46R  [TP_Harwin_S2761_46R]  (hidden comment: TP_Harwin_S2761_46R)
TP9  Series: 5006  [TP_Keystone_Electronics_5006]  (hidden comment: TP_Keystone_Electronics_5006)

### Ports
3V3_SENSE+ (out), 3V3_SENSE- (out)

### Nets
3.3V: C5.1 C6.1 FB3.2 TP8.1  [also labelled 3V3_BUS]
+3V3_IN: F3.1 TP7.1
TRB_GND: C5.2 C6.2 R6.1 TP9.1
3V3_SENSE_N: R5.4 ; port 3V3_SENSE-
3V3_SENSE_P: R5.1 ; port 3V3_SENSE+
NetD7_1: D7.1 Q3.3(S) R5.2
NetD7_2: D7.2 Q3.1(G) R6.2
NetF3_2: F3.2 Q3.2(D)
NetFB3_1: FB3.1 R5.3

### Notes on the sheet
- 475 Portola Plaza
- GAPS TOF
- igarcia91@g.ucla.edu
- Los Angeles, CA
- 310-825-0344
- Size:
- Date:
- Letter
- Revision:
- Time:
- Sheet
- of
- andrew.peck@cern.ch
- spq@ucla.edu
- File:

### Library data of the parts
C5 C6 = Cap_Kemet_T521B226M025ATE100_22uF: as C52 on sheet MarsCarrier_PWR; Supplier 1: Mouser; Supplier Part Number 1: 80-T521B226M25ATE100
D7 = BZT52C4V3-7-F: as D19 on sheet MarsCarrier_PWR; Manufacturer_Part_Number: BZT52C4V3-7-F; RefDes: RefDes; Supplier 1: Mouser; Supplier Part Number 1: 621-BZT52C4V3-F; Series: BZT52C4V3-7-F
F3 = 0ZCF0300BF2C: as F5 on sheet MarsCarrier_PWR; Supplier 1: Mouser; Supplier 2: Digi-Key; Supplier Part Number 1: 530-0ZCF0300BF2C; Supplier Part Number 2: 507-2072-6-ND; Series: 0ZCF0300BF2C
FB3 = FBMH4532HM681-T: as FB5 on sheet MarsCarrier_PWR; ComponentLink1Description: Manufacturer URL; ComponentLink2Description: Datasheet; DatasheetVersion: 09/2014; ComponentLink3URL: http://www.yuden.co.jp/productdata/catalog/en/chipbeads01_e.pdf; ComponentLink3Description: Package Specification; ComponentLink1URL: http://www.t-yuden.com/; Mounting Technology: Surface Mount; Packing: Taping; Temperature Range: -40 to 125 degC; PartNumber: FBMH4532HM681-T; PackageDescription: 2-Pin Surface Mount Device, Body 4.5 x 3.2 mm, Height 3.5 mm; ComponentLink2URL: http://www.yuden.co.jp/productdata/catalog/en/chipbeads01_e.pdf; RoHS: TRUE; Supplier 1: Digi-Key; Supplier Part Number 1: 587-1761-6-ND
Q3 = Mos_ROHM_RSJ250P10FRATL_25A: as Q4 on sheet MarsCarrier_PWR; Supplier 1: Mouser; Supplier Part Number 1: 755-RSJ250P10FRATL
R5 = LVK24R039FER: as R3 on sheet 3V3_DIST_ZYNQ; Manufacturer_Part_Number: LVK24R039FER; Copyright: Copyright (C) 2018 Accelerated Designs. All rights reserved; RefDes: RefDes; Type: DEV
R6 = CMP-1012-00114-1: as R22 on sheet MarsCarrier_PWR; Tolerance: 5 %; Power: 0.1 W; Technology: SMT
TP7 TP8 = TP_Harwin_S2761_46R: as TP18 on sheet 3V_ADC_SUPPLY; Supplier 1: Newark; Supplier Part Number 1: 76Y5391
TP9 = TP_Keystone_Electronics_5006: as TP19 on sheet 3V_ADC_SUPPLY; Supplier 1: Mouser; Supplier Part Number 1: 534-5006

## Sheet Sensors.SchDoc: My title
size A3; Organization: University of California; Address1: 475 Portola Plaza; Address2: Los Angeles, CA 90095; DocumentNumber: 20; Revision: R01; SheetNumber: 20; SheetTotal: 35
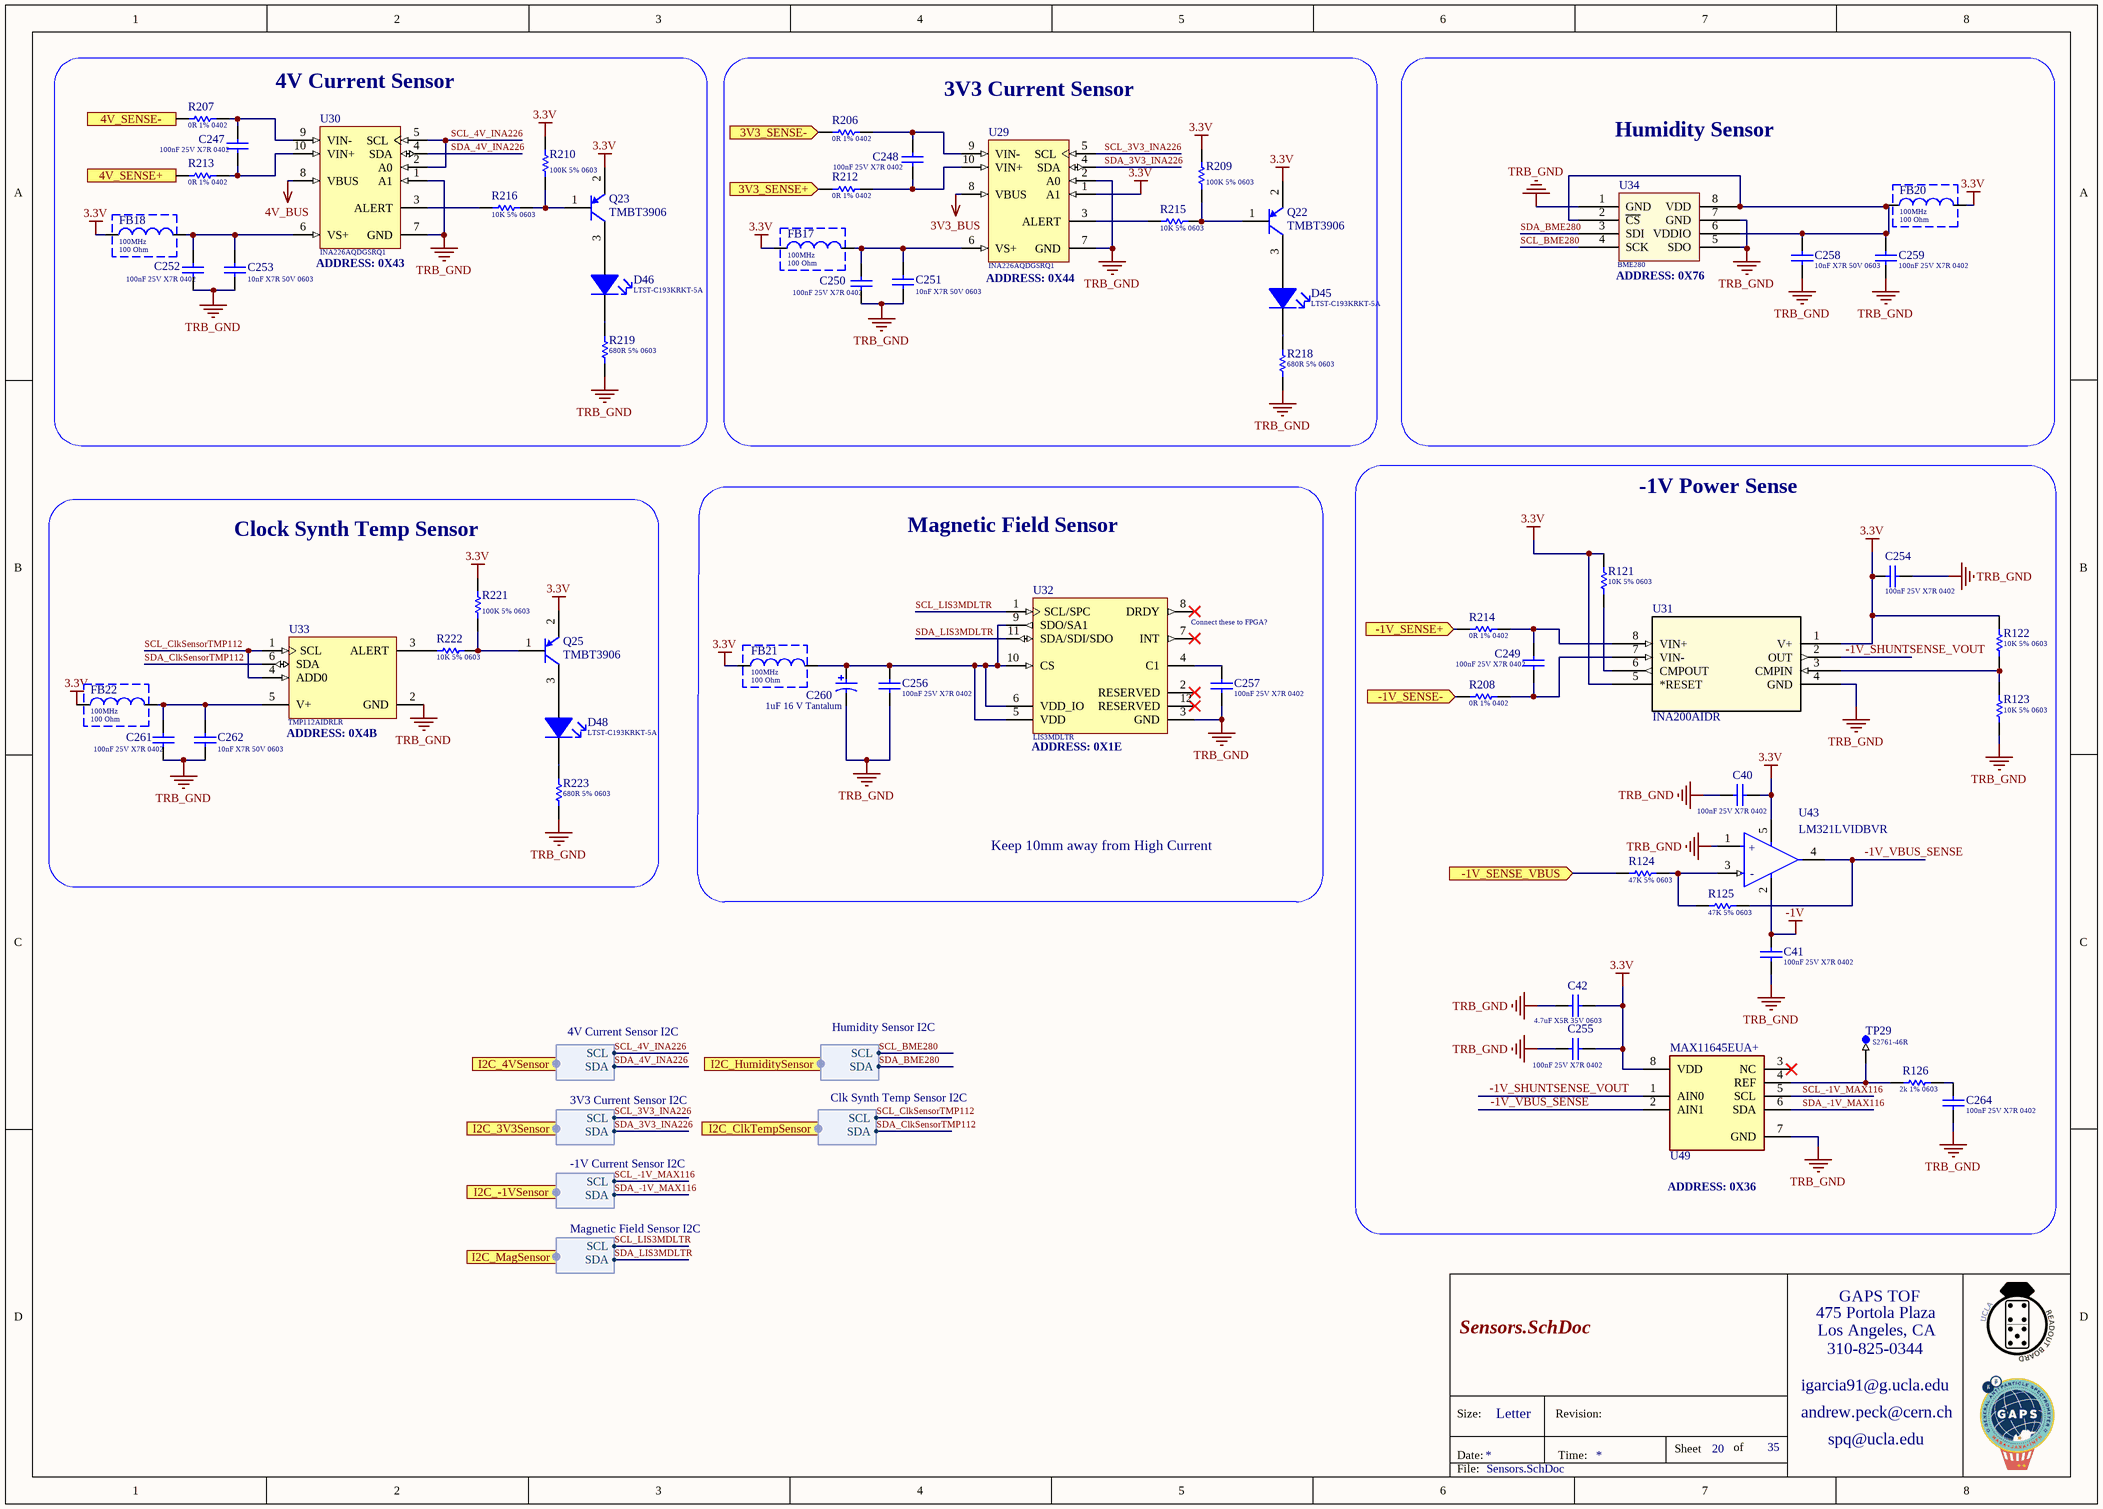
[diagram p23: Sensors.SchDoc]

### Parts
C40  Capacitance: 100nF 25V X7R 0402  [Cap_Taiyo_Yuden_TMK105B7104KV-FR_100nF]  (hidden comment: Cap_Taiyo_Yuden_TMK105B7104KV-FR_100nF)
C41  Capacitance: 100nF 25V X7R 0402  [Cap_Taiyo_Yuden_TMK105B7104KV-FR_100nF]  (hidden comment: Cap_Taiyo_Yuden_TMK105B7104KV-FR_100nF)
C42  Capacitance: 4.7uF X5R 35V 0603  [Cap_Murata_ZRB18AR6YA475ME05L_4.7uF]  (hidden comment: Cap_Murata_ZRB18AR6YA475ME05L_4.7uF)
C247  Capacitance: 100nF 25V X7R 0402  [Cap_Taiyo_Yuden_TMK105B7104KV-FR_100nF]  (hidden comment: Cap_Taiyo_Yuden_TMK105B7104KV-FR_100nF)
C248  Capacitance: 100nF 25V X7R 0402  [Cap_Taiyo_Yuden_TMK105B7104KV-FR_100nF]  (hidden comment: Cap_Taiyo_Yuden_TMK105B7104KV-FR_100nF)
C249  Capacitance: 100nF 25V X7R 0402  [Cap_Taiyo_Yuden_TMK105B7104KV-FR_100nF]  (hidden comment: Cap_Taiyo_Yuden_TMK105B7104KV-FR_100nF)
C250  Capacitance: 100nF 25V X7R 0402  [Cap_Taiyo_Yuden_TMK105B7104KV-FR_100nF]  (hidden comment: Cap_Taiyo_Yuden_TMK105B7104KV-FR_100nF)
C251  Capacitance: 10nF X7R 50V 0603  [Kemet_C0603_0]  (hidden comment: Cap_Kemet_C0603C103J5RACTU_eec)
C252  Capacitance: 100nF 25V X7R 0402  [Cap_Taiyo_Yuden_TMK105B7104KV-FR_100nF]  (hidden comment: Cap_Taiyo_Yuden_TMK105B7104KV-FR_100nF)
C253  Capacitance: 10nF X7R 50V 0603  [Kemet_C0603_0]  (hidden comment: Cap_Kemet_C0603C103J5RACTU_eec)
C254  Capacitance: 100nF 25V X7R 0402  [Cap_Taiyo_Yuden_TMK105B7104KV-FR_100nF]  (hidden comment: Cap_Taiyo_Yuden_TMK105B7104KV-FR_100nF)
C255  Capacitance: 100nF 25V X7R 0402  [Cap_Taiyo_Yuden_TMK105B7104KV-FR_100nF]  (hidden comment: Cap_Taiyo_Yuden_TMK105B7104KV-FR_100nF)
C256  Capacitance: 100nF 25V X7R 0402  [Cap_Taiyo_Yuden_TMK105B7104KV-FR_100nF]  (hidden comment: Cap_Taiyo_Yuden_TMK105B7104KV-FR_100nF)
C257  Capacitance: 100nF 25V X7R 0402  [Cap_Taiyo_Yuden_TMK105B7104KV-FR_100nF]  (hidden comment: Cap_Taiyo_Yuden_TMK105B7104KV-FR_100nF)
C258  Capacitance: 10nF X7R 50V 0603  [Kemet_C0603_0]  (hidden comment: Cap_Kemet_C0603C103J5RACTU_eec)
C259  Capacitance: 100nF 25V X7R 0402  [Cap_Taiyo_Yuden_TMK105B7104KV-FR_100nF]  (hidden comment: Cap_Taiyo_Yuden_TMK105B7104KV-FR_100nF)
C260  1uF 16 V Tantalum  [KEMT-T491A105K016AT_L]
C261  Capacitance: 100nF 25V X7R 0402  [Cap_Taiyo_Yuden_TMK105B7104KV-FR_100nF]  (hidden comment: Cap_Taiyo_Yuden_TMK105B7104KV-FR_100nF)
C262  Capacitance: 10nF X7R 50V 0603  [Kemet_C0603_0]  (hidden comment: Cap_Kemet_C0603C103J5RACTU_eec)
C264  Capacitance: 100nF 25V X7R 0402  [Cap_Taiyo_Yuden_TMK105B7104KV-FR_100nF]  (hidden comment: Cap_Taiyo_Yuden_TMK105B7104KV-FR_100nF)
D45  LTST-C193KRKT-5A  [Led_Lite-On_LTST-C193KGKT-5A_Red]
D46  LTST-C193KRKT-5A  [Led_Lite-On_LTST-C193KGKT-5A_Red]
D48  LTST-C193KRKT-5A  [Led_Lite-On_LTST-C193KGKT-5A_Red]
FB17  Measuring Frequency: 100MHz  Impedance: 100 Ohm  [FB_Wurth_Electronics_742792731_100Ohms]  (hidden comment: 742792731)
FB18  Measuring Frequency: 100MHz  Impedance: 100 Ohm  [FB_Wurth_Electronics_742792731_100Ohms]  (hidden comment: 742792731)
FB20  Measuring Frequency: 100MHz  Impedance: 100 Ohm  [FB_Wurth_Electronics_742792731_100Ohms]  (hidden comment: 742792731)
FB21  Measuring Frequency: 100MHz  Impedance: 100 Ohm  [FB_Wurth_Electronics_742792731_100Ohms]  (hidden comment: 742792731)
FB22  Measuring Frequency: 100MHz  Impedance: 100 Ohm  [FB_Wurth_Electronics_742792731_100Ohms]  (hidden comment: 742792731)
Q22  Series: TMBT3906  [BJT_PNP_Toshiba_TMBT3906]  (hidden comment: BJT_PNP_Toshiba_TMBT3906)
Q23  Series: TMBT3906  [BJT_PNP_Toshiba_TMBT3906]  (hidden comment: BJT_PNP_Toshiba_TMBT3906)
Q25  Series: TMBT3906  [BJT_PNP_Toshiba_TMBT3906]  (hidden comment: BJT_PNP_Toshiba_TMBT3906)
R121  10K 5% 0603  [RESC0603(1608)_L]
R122  10K 5% 0603  [RESC0603(1608)_L]
R123  10K 5% 0603  [RESC0603(1608)_L]
R124  47K 5% 0603  [RESC0603(1608)_L]
R125  47K 5% 0603  [RESC0603(1608)_L]
R126  2k 1% 0603  [RESC1608X55X30ML15T15]
R206  Resistance: 0R 1% 0402  [Res_Vishay_CRCW04020000Z0EDC_0_Ohm]  (hidden comment: Res_Vishay_CRCW04020000Z0EDC_0_Ohm)
R207  Resistance: 0R 1% 0402  [Res_Vishay_CRCW04020000Z0EDC_0_Ohm]  (hidden comment: Res_Vishay_CRCW04020000Z0EDC_0_Ohm)
R208  Resistance: 0R 1% 0402  [Res_Vishay_CRCW04020000Z0EDC_0_Ohm]  (hidden comment: Res_Vishay_CRCW04020000Z0EDC_0_Ohm)
R209  100K 5% 0603  [RESC0603(1608)_N]
R210  100K 5% 0603  [RESC0603(1608)_N]
R212  Resistance: 0R 1% 0402  [Res_Vishay_CRCW04020000Z0EDC_0_Ohm]  (hidden comment: Res_Vishay_CRCW04020000Z0EDC_0_Ohm)
R213  Resistance: 0R 1% 0402  [Res_Vishay_CRCW04020000Z0EDC_0_Ohm]  (hidden comment: Res_Vishay_CRCW04020000Z0EDC_0_Ohm)
R214  Resistance: 0R 1% 0402  [Res_Vishay_CRCW04020000Z0EDC_0_Ohm]  (hidden comment: Res_Vishay_CRCW04020000Z0EDC_0_Ohm)
R215  10K 5% 0603  [RESC0603(1608)_L]
R216  10K 5% 0603  [RESC0603(1608)_L]
R218  680R 5% 0603  [RESC0603(1608)_L]
R219  680R 5% 0603  [RESC0603(1608)_L]
R221  100K 5% 0603  [RESC0603(1608)_N]
R222  10K 5% 0603  [RESC0603(1608)_L]
R223  680R 5% 0603  [RESC0603(1608)_L]
TP29  Series: S2761-46R  [TP_Harwin_S2761_46R]  (hidden comment: TP_Harwin_S2761_46R)
U29  INA226AQDGSRQ1  [INA226AQDGSRQ1]
U30  INA226AQDGSRQ1  [INA226AQDGSRQ1]
U31  INA200AIDR  [D8]
U32  LIS3MDLTR  [LIS3MDLTR]
U33  TMP112AIDRLR  [TMP112AIDRLR]
U34  BME280  [BME280]
U43  LM321LVIDBVR  [Texas_Instruments_LM321LVIDBVR_MFG]
U49  MAX11645EUA+  [Maxim_Electronics_8-uMAX_0]

### Blocks framed on the sheet
4V Current Sensor: C247 C252 C253 D46 FB18 Q23 R207 R210 R213 R216 R219 U30
3V3 Current Sensor: C248 C250 C251 D45 FB17 Q22 R206 R209 R212 R215 R218 U29
Humidity Sensor: C258 C259 FB20 U34
Clock Synth Temp Sensor: C261 C262 D48 FB22 Q25 R221-R223 U33
-1V Power Sense: C40-C42 C249 C254 C255 C264 R121-R126 R208 R214 TP29 U31 U43 U49

### Ports
3V3_SENSE+ (in), 3V3_SENSE- (in), 4V_SENSE+ (in), 4V_SENSE- (in), -1V_SENSE+ (in), -1V_SENSE- (in), -1V_SENSE_VBUS (in), I2C_3V3Sensor (harness 3V3 Current Sensor I2C), I2C_4VSensor (harness 4V Current Sensor I2C), I2C_-1VSensor (harness -1V Current Sensor I2C), I2C_ClkTempSensor (harness Clk Synth Temp Sensor I2C), I2C_HumiditySensor (harness Humidity Sensor I2C), I2C_MagSensor (harness Magnetic Field Sensor I2C)

### Harnesses
4V Current Sensor I2C: SCL, SDA
3V3 Current Sensor I2C: SCL, SDA
-1V Current Sensor I2C: SCL, SDA
Magnetic Field Sensor I2C: SCL, SDA
Humidity Sensor I2C: SCL, SDA
Clk Synth Temp Sensor I2C: SCL, SDA

### Nets
3.3V: C40.2 C42.1 C254.2 C255.2 FB17.1 FB18.1 FB20.2 FB21.1 FB22.1 Q22.2(E) Q23.2(E) Q25.2(E) R121.1 R122.1 R209.2 R210.2 R221.2 U29.1(A1) U29.8(VBUS) U31.1(V+) U31.5(*RESET) U43.5(V+) U49.8(VDD)  [also labelled 3V3_BUS]
4V_BUS: U30.8(VBUS)  [project net 4V]
-1V: C41.2 R124.2 U43.2(V-) ; port -1V_SENSE_VBUS  [project net -1V_VBUS]
TRB_GND: C40.1 C41.1 C42.2 C250.1 C251.2 C252.1 C253.2 C254.1 C255.1 C256.2 C257.2 C258.2 C259.2 C260.2 C261.1 C262.2 C264.1 R123.2 R218.1 R219.1 R223.1 U29.2(A0) U29.7(GND) U30.1(A1) U30.7(GND) U31.4(GND) U32.3(GND) U33.2(GND) U34.1(GND) U34.5(SDO) U34.7(GND) U43.1(IN+) U49.7(GND)
3V3_SENSE_N: R206.2 ; port 3V3_SENSE-
3V3_SENSE_P: R212.2 ; port 3V3_SENSE+
4V_SENSE_N: R207.2 ; port 4V_SENSE-
4V_SENSE_P: R213.2 ; port 4V_SENSE+
-1V_SENSE_N: R208.2 ; port -1V_SENSE-
-1V_SENSE_P: R214.2 ; port -1V_SENSE+
-1V_SHUNTSENSE_VOUT: U31.2(OUT) U49.1(AIN0)
-1V_VBUS_SENSE: R125.1 U43.4(OUT) U49.2(AIN1)
SCL_3V3_INA226: U29.5(SCL) ; port I2C_3V3Sensor.SCL
SCL_4V_INA226: U30.2(A0) U30.5(SCL) ; port I2C_4VSensor.SCL
SCL_-1V_MAX116: U49.5(SCL) ; port I2C_-1VSensor.SCL
SCL_BME280: U34.4(SCK) ; port I2C_HumiditySensor.SCL
SCL_ClkSensorTMP112: U33.1(SCL) U33.4(ADD0) ; port I2C_ClkTempSensor.SCL
SCL_LIS3MDLTR: U32.1(SCL/SPC) ; port I2C_MagSensor.SCL
SDA_3V3_INA226: U29.4(SDA) ; port I2C_3V3Sensor.SDA
SDA_4V_INA226: U30.4(SDA) ; port I2C_4VSensor.SDA
SDA_-1V_MAX116: U49.6(SDA) ; port I2C_-1VSensor.SDA
SDA_BME280: U34.3(SDI) ; port I2C_HumiditySensor.SDA
SDA_ClkSensorTMP112: U33.6(SDA) ; port I2C_ClkTempSensor.SDA
SDA_LIS3MDLTR: U32.11(SDA/SDI/SDO) ; port I2C_MagSensor.SDA
NetC247_1: C247.1 R213.1 U30.10(VIN+)
NetC247_2: C247.2 R207.1 U30.9(VIN-)
NetC248_1: C248.1 R212.1 U29.10(VIN+)
NetC248_2: C248.2 R206.1 U29.9(VIN-)
NetC249_1: C249.1 R208.1 U31.7(VIN-)
NetC249_2: C249.2 R214.1 U31.8(VIN+)
NetC250_2: C250.2 C251.1 FB17.2 U29.6(VS+)
NetC252_2: C252.2 C253.1 FB18.2 U30.6(VS+)
NetC256_1: C256.1 C260.1 FB21.2 U32.5(VDD) U32.6(VDD_IO) U32.9(SDO/SA1) U32.10(CS)
NetC257_1: C257.1 U32.4(C1)
NetC258_1: C258.1 C259.1 FB20.1 U34.2(~{CS}) U34.6(VDDIO) U34.8(VDD)
NetC261_2: C261.2 C262.1 FB22.2 U33.5(V+)
NetC264_2: C264.2 R126.2
NetD45_1: D45.1(K) R218.2
NetD45_2: D45.2(A) Q22.3(C)
NetD46_1: D46.1(K) R219.2
NetD46_2: D46.2(A) Q23.3(C)
NetD48_1: D48.1(K) R223.2
NetD48_2: D48.2(A) Q25.3(C)
NetQ22_1: Q22.1(B) R209.1 R215.1
NetQ23_1: Q23.1(B) R210.1 R216.1
NetQ25_1: Q25.1(B) R221.1 R222.1
NetR121_2: R121.2 U31.6(CMPOUT)
NetR122_2: R122.2 R123.1 U31.3(CMPIN)
NetR124_1: R124.1 R125.2 U43.3(IN-)
NetR126_1: R126.1 TP29.1 U49.4(REF)
NetR215_2: R215.2 U29.3(ALERT)
NetR216_2: R216.2 U30.3(ALERT)
NetR222_2: R222.2 U33.3(ALERT)

Not connected (* = marked no-connect by the designer): U32 2(RESERVED)* 7(INT)* 8(DRDY)* 12(RESERVED)*; U49 3(NC)*

### Notes on the sheet
- (near U30) ADDRESS: 0X43
- (near U29) ADDRESS: 0X44
- (near U34) ADDRESS: 0X76
- Magnetic Field Sensor
- (near U32) Connect these to FPGA?
- (near U33) ADDRESS: 0X4B
- (near U32) ADDRESS: 0X1E
- Keep 10mm away from High Current
- (near U49) ADDRESS: 0X36
- 475 Portola Plaza
- GAPS TOF
- igarcia91@g.ucla.edu
- Los Angeles, CA
- 310-825-0344
- Size:
- Date:
- Letter
- Revision:
- Time:
- Sheet
- of
- andrew.peck@cern.ch
- spq@ucla.edu
- File:
- (in symbol LM321LVIDBVR) +; -

### Library data of the parts
C40 C41 C247-C250 C252 C254-C257 C259 C261 C264 = Cap_Taiyo_Yuden_TMK105B7104KV-FR_100nF: CAP CER 100nF 25V X7R 0402; Supplier 1: Mouser; Supplier Part Number 1: 963-TMK105B7104KV-FR
C42 = Cap_Murata_ZRB18AR6YA475ME05L_4.7uF: CAP CER 4.7uF 35V X5R 0603; Supplier 1: Mouser; Supplier Part Number 1: 81-ZRB18AR6YA475ME5L
C251 C253 C258 C262 = Cap_Kemet_C0603C103J5RACTU_eec: as C22 on sheet 3V_ADC_SUPPLY; Part Number: C0603C103J5RACTU; helpURL: https://upverter.com/upn/revision/8a8d0c297e33ac74/; ComponentLink2Description: Datasheet; Temperature: -55°C to +125°C; Package: C0603; Supplier 2: Mouser; Price: 0.0184203126773; Supplier 1: Digi-Key; ComponentLink1URL: https://upverter.com/upn/revision/8a8d0c297e33ac74/; Supplier Part Number 2: 80-C0603C103J5R; Supplier Part Number 1: 399-1092-1-ND; Value: 10nF; ComponentLink1Description: Upverter; ComponentLink2URL: https://content.kemet.com/datasheets/KEM_C1002_X7R_SMD.pdf; RoHS: TRUE; Mouser Part Number: 80-C0603C103J5R; Temperature Range High: +125°C; Digikey Description: CAP CER 10000PF 50V X7R 0603; Digikey Part Number: 399-1092-1-ND; Lead Free: yes; Temperature Range Low: -55°C; Voltage: 50V
C260 = CMP-2000-07186-1: Tantalun Capacitor, 1 uF, +/- 10%, 16 V, -55 to 125 degC, 2-Pin SMD, RoHS, Tape and Reel; Manufacturer: Kemet; Manufacturer Size Code: A; Type: Molded; Online Catalog: T491Series; Lifetime @ Temp.: 2000Hrs@85°C; Catalog Drawings: T49x,T5xxSeries_A-side1T49x,T5xxSeries_A,B-side2T49x,T5xxSeries_A,SBottom; Other Names: 399-3678-6; EDA / CAD Models: DownloadfromAcceleratedDesigns; Capacitance: 1.0µF; ESR (Equivalent Series Resistance): 10Ohm; Voltage - Rated: 16V; Product Training Modules: CapacitorBasics-TypicalUsesforCapacitorsDeratingGuidelinesforSurfaceMountTantalumCapacitors; Category: Capacitors; Lead Spacing: -; Package Description: 2-Pin Surface Mounted Device, Body 3.2 x 1.6 mm; Height - Seated (Max): 0.071"(1.80mm); Mounting Technology: SurfaceMount; Mounting Type: SurfaceMount; Standard Package: 1; Tolerance: ±10%; Datasheet Version: 06/2016; Manufacturer URL: http://www.kemet.com/; Packaging: Digi-Reel®; Family: TantalumCapacitors; Series: T491; Size / Dimension: 0.126"Lx0.063"W(3.20mmx1.60mm); Package / Case: 1206(3216Metric); Datasheet URL: http://capacitoredge.kemet.com/capedge2/DataSheet/Datasheet-T491A105K016AT.pdf?pn=T491A105K016AT; Operating Temperature: -55°C~125°C; Package Reference: 1206; Features: GeneralPurpose
D45 D46 D48 = Led_Lite-On_LTST-C193KGKT-5A_Red: Standard LEDs - SMD Red 470nm 28mcd 20mA; Supplier 1: Mouser; Supplier Part Number 1: 859-LTSTC193KRKT5A; Series: LTST-C193KRKT-5A
FB17 FB18 FB20-FB22 = FB_Wurth_Electronics_742792731_100Ohms: FB SMD 100 OHM 25% 1.2A 0402; DC Resistance: 90mOhm; Supplier 1: Mouser; Supplier Part Number 1: 710-742792731
Q22 Q23 Q25 = BJT_PNP_Toshiba_TMBT3906: as Q7 on sheet MarsCarrier_PWR; Supplier 1: Mouser; Supplier Part Number 1: 757-TMBT3906LM; Manufacturer: Toshiba
R121-R123 R215 R216 R222 = CMP-1012-00098-1: as R34 on sheet MarsCarrier_PWR; Technology: SMT; Tolerance: 5 %; Power: 0.1 W
R124 R125 = CMP-1012-00114-1: as R22 on sheet MarsCarrier_PWR; Tolerance: 5 %; Power: 0.1 W; Technology: SMT
R126 = CMP-2000-00317-1: ERJ-3EKF2001V RES SMD 2K OHM 1% 1/10W 0603; Manufacturer: Panasonic; Part Number: ERJ-3EKF2001V
R206-R208 R212-R214 = Res_Vishay_CRCW04020000Z0EDC_0_Ohm: 0R 0.062W 1% 0402 (1005 Metric)  SMD; Supplier 1: Mouser; Supplier Part Number 1: 71-CRCW04020000Z0EDC
R209 R210 R221 = CMP-1012-00122-1: as R32 on sheet MarsCarrier_PWR; Tolerance: 5 %; Power: 0.1 W; Technology: SMT
R218 R219 R223 = CMP-1012-00070-1: as R23 on sheet MarsCarrier_PWR; Tolerance: 5 %; Technology: SMT; Power: 0.1 W
TP29 = TP_Harwin_S2761_46R: as TP18 on sheet 3V_ADC_SUPPLY; Supplier 1: Newark; Supplier Part Number 1: 76Y5391
U29 U30 = INA226AQDGSRQ1: as U14 on sheet MarsCarrier_PWR; Supplier 1: Mouser; Supplier Part Number 1: 595-INA226AQDGSRQ1
U31 = INA200AIDR: High-Side Measurement Current-Shunt Monitor with Comparator and Reference; Manufacturer: Texas Instruments; GENERIC_PART_NUMBER: INA200; INDUSTRY_STD_PKG_TYPE: SOIC; FAMILY_NAME: CURRENT SHUNT MONITOR; PIN_COUNT: 8; PACKAGE_DESIGNATOR: D; Datasheet_URL: http://www.ti.com/lit/gpn/INA200; Vendor: Texas Instruments; Manufacturer_Part_Number: INA200AIDR; Copyright: Copyright (C) 2018 Accelerated Designs. All rights reserved; RefDes: RefDes; Type: DEV
U32 = LIS3MDLTR: Board Mount Hall Effect / Magnetic Sensors Ultra Lo-Pwr Hi Perf 3-Axis 1.9-3.6V; Supplier 1: Mouser; Supplier Part Number 1: 511-LIS3MDLTR
U33 = TMP112AIDRLR: Board Mount Temperature Sensors Hi-Prec Lo-Pwr Dig Temp Sensor; Supplier 1: Mouser; Supplier Part Number 1: 595-TMP112AIDRLR
U34 = BME280: Board Mount Humidity Sensors; Supplier 1: Mouser; Supplier Part Number 1: 262-BME280
U43 = LM321LVIDBVR: IC OPAMP GP 1 CIRCUIT SOT23-5; Part Number: LM321LVIDBVR; Supplier 1: Mouser; Supplier Part Number 1: 595-LM321LVIDBVR
U49 = MAX11645EUA+: Part Number: MAX11645EUA+; ComponentLink1Description: helpURL; ComponentLink1URL: https://www.maximintegrated.com/en/products/analog/data-converters/analog-to-digital-converters/MAX11645.html; Supplier 1: Mouser; Supplier Part Number 1: https://www.mouser.com/ProductDetail/Maxim-Integrated/MAX11645EUA%2B?qs=Bakm8ERcljromEtBj8vNxg%3D%3D